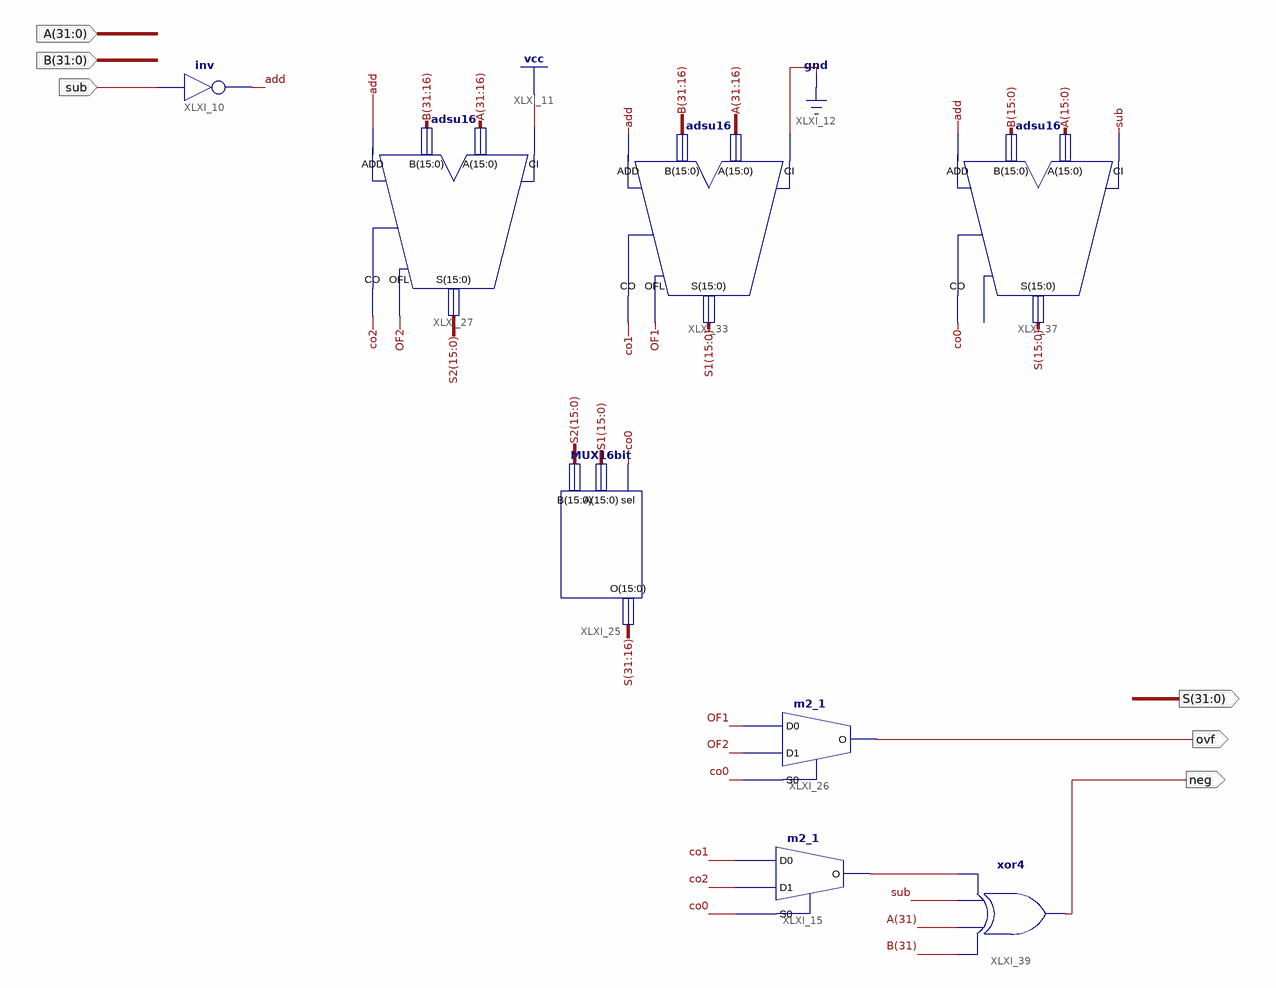
[diagram p0: schematic sheet 1]
// Xilinx ISE schematic ADD_SUB_32.sch (spartan3) as structural Verilog: 8 symbols, 6 ports
module ADD_SUB_32 (
  input  [31:0] A,
  input  [31:0] B,
  input  sub,
  output neg,
  output ovf,
  output [31:0] S
);

  wire add, co0, co1, co2, OF1, OF2, XLXN_37;
  wire [15:0] S1, S2;

  not XLXI_10 (add, sub);
  m2_1 XLXI_26 (.D0(OF1), .D1(OF2), .S0(co0), .O(ovf));
  MUX16bit XLXI_25 (.sel(co0), .A(S1), .B(S2), .O(S[31:16]));
  adsu16 XLXI_27 (.A(A[31:16]), .ADD(add), .B(B[31:16]), .CI(1'b1), .CO(co2), .OFL(OF2), .S(S2));
  adsu16 XLXI_33 (.A(A[31:16]), .ADD(add), .B(B[31:16]), .CI(1'b0), .CO(co1), .OFL(OF1), .S(S1));
  adsu16 XLXI_37 (.A(A[15:0]), .ADD(add), .B(B[15:0]), .CI(sub), .CO(co0), .S(S[15:0]));  // open: OFL
  xor XLXI_39 (neg, B[31], A[31], sub, XLXN_37);
  m2_1 XLXI_15 (.D0(co1), .D1(co2), .S0(co0), .O(XLXN_37));
endmodule
